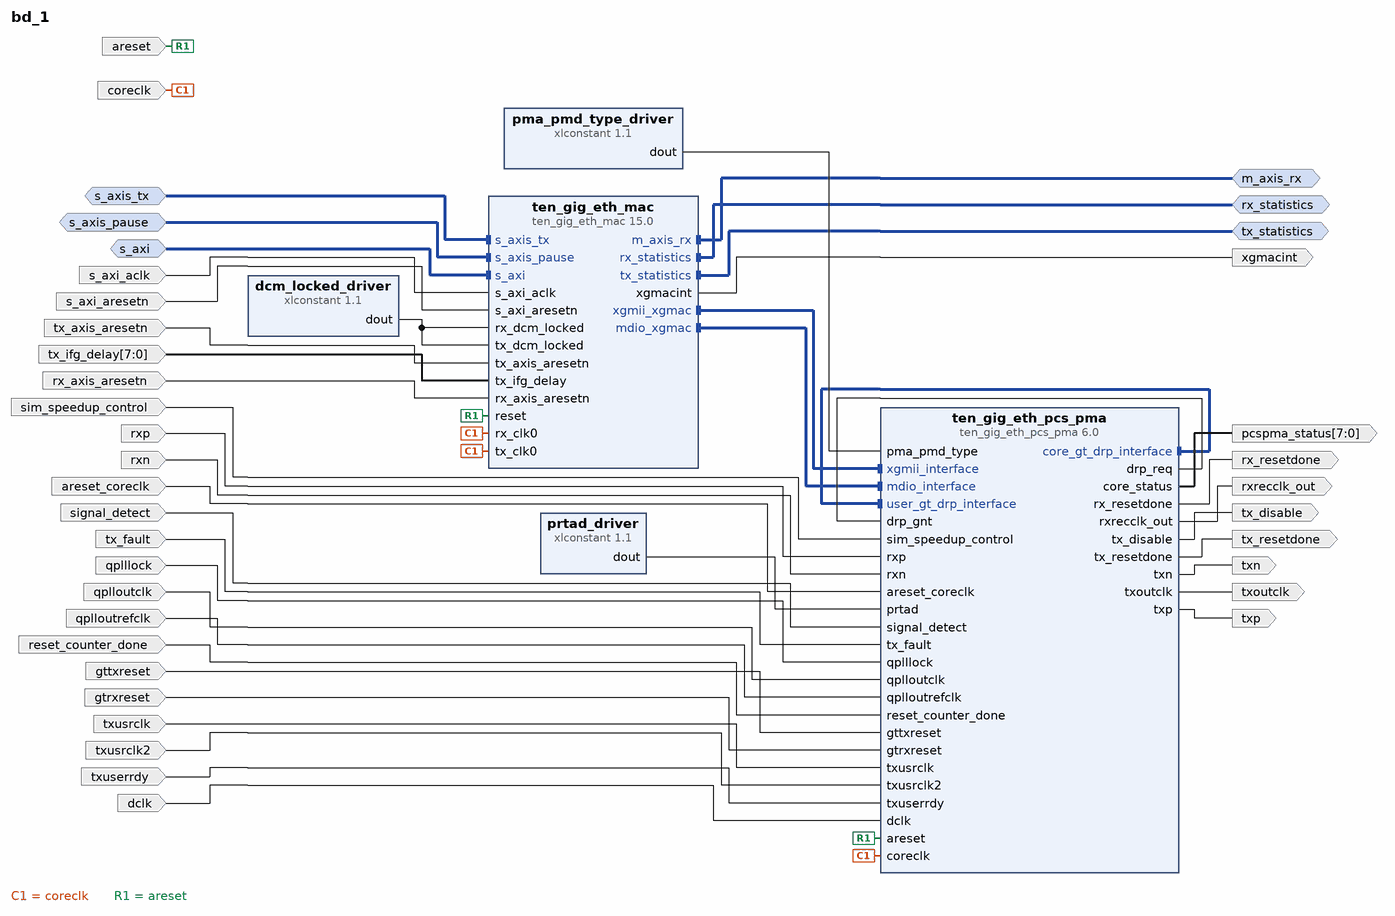
[diagram p0: block diagram of the top level]
# Vivado block design bd_1, Vivado 2015.4
create_bd_design bd_1

create_bd_intf_port -mode Slave -vlnv xilinx.com:interface:axis_rtl:1.0 s_axis_tx
set_property -dict {CONFIG.FREQ_HZ 156250000} [get_bd_intf_ports s_axis_tx]
create_bd_intf_port -mode Master -vlnv xilinx.com:interface:axis_rtl:1.0 m_axis_rx
set_property -dict {CONFIG.TDATA_NUM_BYTES 8 CONFIG.HAS_TKEEP 1 CONFIG.FREQ_HZ 156250000} [get_bd_intf_ports m_axis_rx]
create_bd_intf_port -mode Slave -vlnv xilinx.com:interface:axis_rtl:1.0 s_axis_pause
set_property -dict {CONFIG.FREQ_HZ 156250000} [get_bd_intf_ports s_axis_pause]
create_bd_intf_port -mode Master -vlnv xilinx.com:display_ten_gig_eth_mac:statistics_rtl:2.0 tx_statistics
create_bd_intf_port -mode Master -vlnv xilinx.com:display_ten_gig_eth_mac:statistics_rtl:2.0 rx_statistics
create_bd_intf_port -mode Slave -vlnv xilinx.com:interface:aximm_rtl:1.0 s_axi
set_property -dict {CONFIG.DATA_WIDTH 32 CONFIG.ADDR_WIDTH 16} [get_bd_intf_ports s_axi]
create_bd_port -dir I -type rst tx_axis_aresetn
create_bd_port -dir I -type rst rx_axis_aresetn
create_bd_port -dir I -from 7 -to 0 tx_ifg_delay
create_bd_port -dir I -type clk dclk
create_bd_port -dir O txp
create_bd_port -dir O txn
create_bd_port -dir I rxp
create_bd_port -dir I rxn
create_bd_port -dir I signal_detect
create_bd_port -dir I tx_fault
create_bd_port -dir O tx_disable
create_bd_port -dir O -from 7 -to 0 pcspma_status
create_bd_port -dir I sim_speedup_control
create_bd_port -dir O -type clk rxrecclk_out
set_property -dict {CONFIG.FREQ_HZ 322265625} [get_bd_ports rxrecclk_out]
create_bd_port -dir I -type clk s_axi_aclk
create_bd_port -dir I -type rst s_axi_aresetn
create_bd_port -dir O -type intr xgmacint
create_bd_port -dir I -type rst areset_coreclk
create_bd_port -dir I -type clk txusrclk
set_property -dict {CONFIG.FREQ_HZ 322265625} [get_bd_ports txusrclk]
create_bd_port -dir I -type clk txusrclk2
set_property -dict {CONFIG.FREQ_HZ 322265625} [get_bd_ports txusrclk2]
create_bd_port -dir O -type clk txoutclk
set_property -dict {CONFIG.FREQ_HZ 322265625} [get_bd_ports txoutclk]
create_bd_port -dir I txuserrdy
create_bd_port -dir O tx_resetdone
create_bd_port -dir O rx_resetdone
create_bd_port -dir I -type clk coreclk
set_property -dict {CONFIG.FREQ_HZ 156250000 CONFIG.ASSOCIATED_ASYNC_RESET tx_axis_aresetn:rx_axis_aresetn} [get_bd_ports coreclk]
create_bd_port -dir I -type rst areset
create_bd_port -dir I -type rst gttxreset
create_bd_port -dir I -type rst gtrxreset
create_bd_port -dir I qplllock
create_bd_port -dir I -type clk qplloutclk
create_bd_port -dir I -type clk qplloutrefclk
set_property -dict {CONFIG.FREQ_HZ 156250000} [get_bd_ports qplloutrefclk]
create_bd_port -dir I reset_counter_done

create_bd_cell -type ip -vlnv xilinx.com:ip:ten_gig_eth_mac:15.0 ten_gig_eth_mac
set_property -dict [list \
  CONFIG.Management_Interface true \
  CONFIG.Management_Frequency 200.00 \
  CONFIG.Statistics_Gathering true \
  CONFIG.Physical_Interface Internal \
  CONFIG.Data_Rate 10Gbps \
  CONFIG.IEEE_1588 None \
  CONFIG.Timer_Format Time_of_day \
  CONFIG.Enable_Priority_Flow_Control false \
  CONFIG.Low_Latency_32_bit_MAC 64bit \
] [get_bd_cells ten_gig_eth_mac]
create_bd_cell -type ip -vlnv xilinx.com:ip:ten_gig_eth_pcs_pma:6.0 ten_gig_eth_pcs_pma
set_property -dict [list \
  CONFIG.MDIO_Management true \
  CONFIG.base_kr BASE-R \
  CONFIG.baser32 64bit \
  CONFIG.IEEE_1588 None \
  CONFIG.Timer_Format Time_of_day \
  CONFIG.SupportLevel 0 \
  CONFIG.TransceiverInExample false \
  CONFIG.TransceiverControl false \
  CONFIG.Locations X0Y0 \
  CONFIG.RefClkRate 156.25 \
  CONFIG.RefClk clk0 \
  CONFIG.DClkRate 100.00 \
] [get_bd_cells ten_gig_eth_pcs_pma]
create_bd_cell -type ip -vlnv xilinx.com:ip:xlconstant:1.1 prtad_driver
set_property -dict {CONFIG.CONST_WIDTH 5 CONFIG.CONST_VAL 0} [get_bd_cells prtad_driver]
create_bd_cell -type ip -vlnv xilinx.com:ip:xlconstant:1.1 dcm_locked_driver
set_property -dict {CONFIG.CONST_WIDTH 1 CONFIG.CONST_VAL 1} [get_bd_cells dcm_locked_driver]
create_bd_cell -type ip -vlnv xilinx.com:ip:xlconstant:1.1 pma_pmd_type_driver
set_property -dict {CONFIG.CONST_WIDTH 3 CONFIG.CONST_VAL 5} [get_bd_cells pma_pmd_type_driver]

# ---- connections ----

connect_bd_intf_net [get_bd_intf_pins ten_gig_eth_pcs_pma/core_gt_drp_interface] [get_bd_intf_pins ten_gig_eth_pcs_pma/user_gt_drp_interface]
connect_bd_intf_net [get_bd_intf_pins ten_gig_eth_mac/xgmii_xgmac] [get_bd_intf_pins ten_gig_eth_pcs_pma/xgmii_interface]
connect_bd_intf_net [get_bd_intf_pins ten_gig_eth_mac/mdio_xgmac] [get_bd_intf_pins ten_gig_eth_pcs_pma/mdio_interface]
connect_bd_intf_net [get_bd_intf_ports s_axis_tx] [get_bd_intf_pins ten_gig_eth_mac/s_axis_tx]
connect_bd_intf_net [get_bd_intf_ports m_axis_rx] [get_bd_intf_pins ten_gig_eth_mac/m_axis_rx]
connect_bd_intf_net [get_bd_intf_ports s_axis_pause] [get_bd_intf_pins ten_gig_eth_mac/s_axis_pause]
connect_bd_intf_net [get_bd_intf_ports tx_statistics] [get_bd_intf_pins ten_gig_eth_mac/tx_statistics]
connect_bd_intf_net [get_bd_intf_ports rx_statistics] [get_bd_intf_pins ten_gig_eth_mac/rx_statistics]
connect_bd_intf_net [get_bd_intf_ports s_axi] [get_bd_intf_pins ten_gig_eth_mac/s_axi]
connect_bd_net [get_bd_ports s_axi_aclk] [get_bd_pins ten_gig_eth_mac/s_axi_aclk]
connect_bd_net [get_bd_ports s_axi_aresetn] [get_bd_pins ten_gig_eth_mac/s_axi_aresetn]
connect_bd_net [get_bd_pins ten_gig_eth_mac/xgmacint] [get_bd_ports xgmacint]
connect_bd_net [get_bd_ports tx_axis_aresetn] [get_bd_pins ten_gig_eth_mac/tx_axis_aresetn]
connect_bd_net [get_bd_ports tx_ifg_delay] [get_bd_pins ten_gig_eth_mac/tx_ifg_delay]
connect_bd_net [get_bd_ports rx_axis_aresetn] [get_bd_pins ten_gig_eth_mac/rx_axis_aresetn]
connect_bd_net [get_bd_ports sim_speedup_control] [get_bd_pins ten_gig_eth_pcs_pma/sim_speedup_control]
connect_bd_net [get_bd_ports rxp] [get_bd_pins ten_gig_eth_pcs_pma/rxp]
connect_bd_net [get_bd_ports rxn] [get_bd_pins ten_gig_eth_pcs_pma/rxn]
connect_bd_net [get_bd_pins ten_gig_eth_pcs_pma/txp] [get_bd_ports txp]
connect_bd_net [get_bd_pins ten_gig_eth_pcs_pma/txn] [get_bd_ports txn]
connect_bd_net [get_bd_pins ten_gig_eth_pcs_pma/tx_disable] [get_bd_ports tx_disable]
connect_bd_net [get_bd_pins ten_gig_eth_pcs_pma/rxrecclk_out] [get_bd_ports rxrecclk_out]
connect_bd_net [get_bd_pins pma_pmd_type_driver/dout] [get_bd_pins ten_gig_eth_pcs_pma/pma_pmd_type]
connect_bd_net [get_bd_ports areset_coreclk] [get_bd_pins ten_gig_eth_pcs_pma/areset_coreclk]
connect_bd_net [get_bd_ports coreclk] \
  [get_bd_pins ten_gig_eth_pcs_pma/coreclk] [get_bd_pins ten_gig_eth_mac/tx_clk0] [get_bd_pins ten_gig_eth_mac/rx_clk0]
connect_bd_net [get_bd_ports signal_detect] [get_bd_pins ten_gig_eth_pcs_pma/signal_detect]
connect_bd_net [get_bd_ports tx_fault] [get_bd_pins ten_gig_eth_pcs_pma/tx_fault]
connect_bd_net [get_bd_ports qplllock] [get_bd_pins ten_gig_eth_pcs_pma/qplllock]
connect_bd_net [get_bd_ports qplloutclk] [get_bd_pins ten_gig_eth_pcs_pma/qplloutclk]
connect_bd_net [get_bd_ports qplloutrefclk] [get_bd_pins ten_gig_eth_pcs_pma/qplloutrefclk]
connect_bd_net [get_bd_pins ten_gig_eth_pcs_pma/core_status] [get_bd_ports pcspma_status]
connect_bd_net [get_bd_ports reset_counter_done] [get_bd_pins ten_gig_eth_pcs_pma/reset_counter_done]
connect_bd_net [get_bd_ports areset] [get_bd_pins ten_gig_eth_pcs_pma/areset] [get_bd_pins ten_gig_eth_mac/reset]
connect_bd_net [get_bd_ports gttxreset] [get_bd_pins ten_gig_eth_pcs_pma/gttxreset]
connect_bd_net [get_bd_ports gtrxreset] [get_bd_pins ten_gig_eth_pcs_pma/gtrxreset]
connect_bd_net [get_bd_pins ten_gig_eth_pcs_pma/tx_resetdone] [get_bd_ports tx_resetdone]
connect_bd_net [get_bd_pins ten_gig_eth_pcs_pma/rx_resetdone] [get_bd_ports rx_resetdone]
connect_bd_net [get_bd_ports txusrclk] [get_bd_pins ten_gig_eth_pcs_pma/txusrclk]
connect_bd_net -net txusrclk2_1 [get_bd_ports txusrclk2] [get_bd_pins ten_gig_eth_pcs_pma/txusrclk2]
connect_bd_net [get_bd_pins ten_gig_eth_pcs_pma/txoutclk] [get_bd_ports txoutclk]
connect_bd_net [get_bd_ports txuserrdy] [get_bd_pins ten_gig_eth_pcs_pma/txuserrdy]
connect_bd_net [get_bd_pins ten_gig_eth_pcs_pma/drp_req] [get_bd_pins ten_gig_eth_pcs_pma/drp_gnt]
connect_bd_net [get_bd_ports dclk] [get_bd_pins ten_gig_eth_pcs_pma/dclk]
connect_bd_net [get_bd_pins prtad_driver/dout] [get_bd_pins ten_gig_eth_pcs_pma/prtad]
connect_bd_net [get_bd_pins dcm_locked_driver/dout] [get_bd_pins ten_gig_eth_mac/tx_dcm_locked] [get_bd_pins ten_gig_eth_mac/rx_dcm_locked]

# ---- address map ----
assign_bd_address -offset 0x0000 -range 64K -target_address_space [get_bd_addr_spaces s_axi] [get_bd_addr_segs ten_gig_eth_mac/s_axi/Reg]

validate_bd_design
save_bd_design
